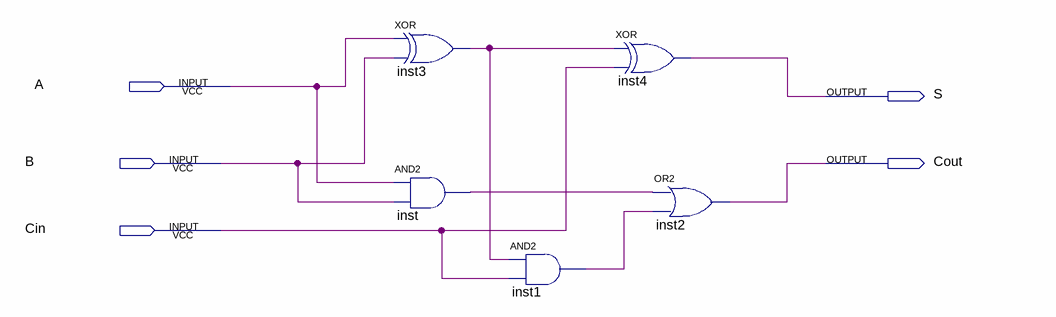
[diagram p0: schematic sheet]
// Quartus schematic FULL_ADDER.bdf as structural Verilog: 5 symbols, 5 pins
module FULL_ADDER (
  input  A,
  input  B,
  input  Cin,
  output S,
  output Cout
);

  wire inst1_out, inst3_out, inst_out;

  xor inst3 (inst3_out, A, B);
  and inst (inst_out, A, B);
  and inst1 (inst1_out, inst3_out, Cin);
  xor inst4 (S, inst3_out, Cin);
  or inst2 (Cout, inst_out, inst1_out);
endmodule
